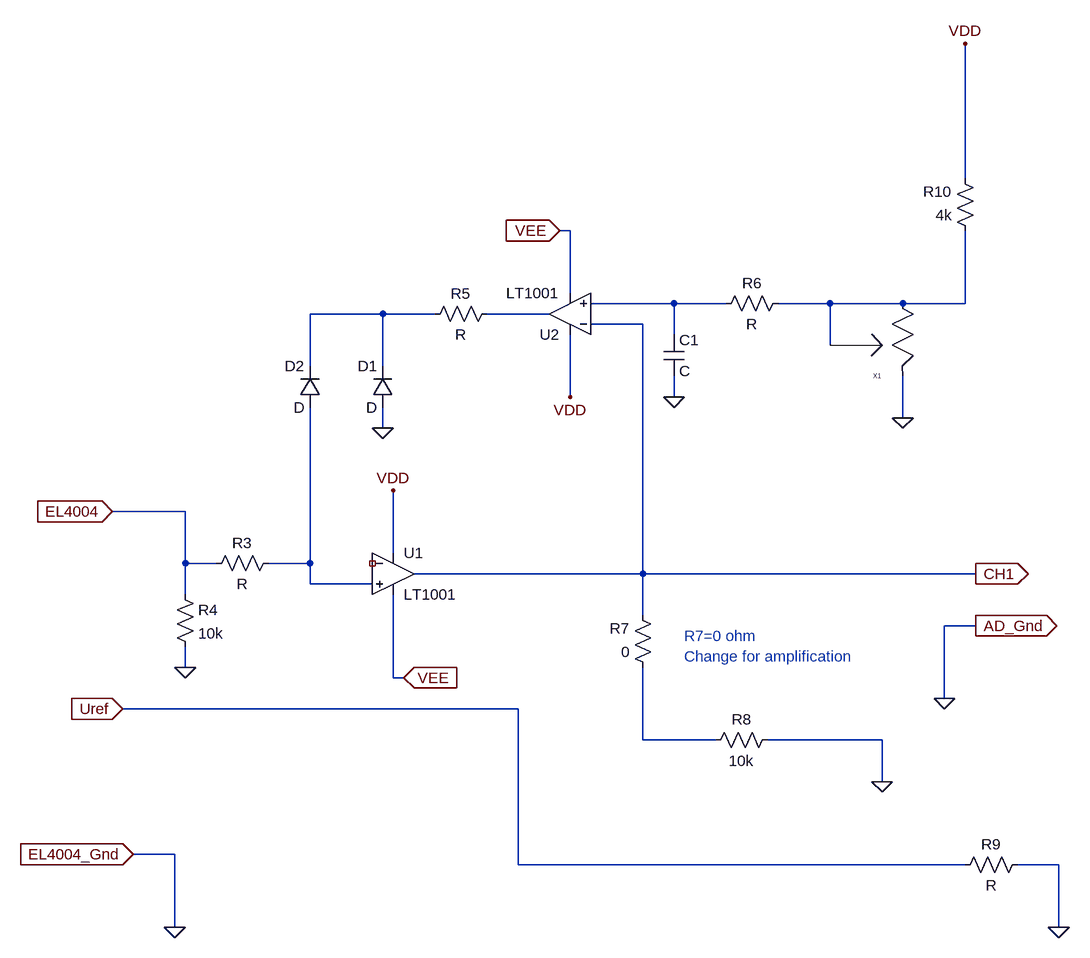
[diagram p0: schematic Booster Buffer.asc]
Booster Buffer.asc, the LTspice schematic file:
Version 4
SHEET 1 1968 692
WIRE 1296 -480 1296 -688
WIRE 688 -400 672 -400
WIRE 688 -304 688 -400
WIRE 848 -288 720 -288
WIRE 928 -288 848 -288
WIRE 1088 -288 1008 -288
WIRE 1200 -288 1088 -288
WIRE 1296 -288 1296 -400
WIRE 1296 -288 1200 -288
WIRE 400 -272 288 -272
WIRE 480 -272 400 -272
WIRE 656 -272 560 -272
WIRE 800 -256 720 -256
WIRE 848 -240 848 -288
WIRE 1088 -224 1088 -288
WIRE 288 -192 288 -272
WIRE 400 -192 400 -272
WIRE 688 -144 688 -240
WIRE 848 -144 848 -176
WIRE 1200 -112 1200 -176
WIRE 400 -96 400 -128
WIRE 96 32 -16 32
WIRE 416 96 416 0
WIRE 96 112 96 32
WIRE 144 112 96 112
WIRE 288 112 288 -128
WIRE 288 112 224 112
WIRE 800 128 800 -256
WIRE 800 128 448 128
WIRE 1312 128 800 128
WIRE 288 144 288 112
WIRE 384 144 288 144
WIRE 96 160 96 112
WIRE 800 192 800 128
WIRE 1312 208 1264 208
WIRE 96 272 96 240
WIRE 416 288 416 160
WIRE 432 288 416 288
WIRE 1264 320 1264 208
WIRE 608 336 0 336
WIRE 800 384 800 272
WIRE 912 384 800 384
WIRE 1168 384 992 384
WIRE 1168 448 1168 384
WIRE 80 560 16 560
WIRE 608 576 608 336
WIRE 1296 576 608 576
WIRE 1440 576 1376 576
WIRE 80 672 80 560
WIRE 1440 672 1440 576
FLAG -16 32 EL4004
IOPIN -16 32 In
FLAG 0 336 Uref
IOPIN 0 336 In
FLAG 16 560 EL4004_Gnd
IOPIN 16 560 In
FLAG 432 288 VEE
IOPIN 432 288 In
FLAG 672 -400 VEE
IOPIN 672 -400 In
FLAG 416 0 VDD
FLAG 688 -144 VDD
FLAG 1296 -688 VDD
FLAG 400 -96 0
FLAG 848 -144 0
FLAG 1264 320 0
FLAG 1168 448 0
FLAG 1312 128 CH1
IOPIN 1312 128 Out
FLAG 1312 208 AD_Gnd
IOPIN 1312 208 Out
FLAG 1200 -112 0
FLAG 96 272 0
FLAG 1440 672 0
FLAG 80 672 0
SYMBOL res 240 96 R90
WINDOW 0 0 56 VBottom 2
WINDOW 3 32 56 VTop 2
SYMATTR InstName R3
SYMBOL res 80 144 R0
SYMATTR InstName R4
SYMATTR Value 10k
SYMBOL res 576 -288 R90
WINDOW 0 0 56 VBottom 2
WINDOW 3 32 56 VTop 2
SYMATTR InstName R5
SYMBOL res 1024 -304 R90
WINDOW 0 0 56 VBottom 2
WINDOW 3 32 56 VTop 2
SYMATTR InstName R6
SYMBOL res 816 288 R180
WINDOW 0 36 76 Left 2
WINDOW 3 36 40 Left 2
SYMATTR InstName R7
SYMATTR Value 0
SYMBOL res 896 400 R270
WINDOW 0 32 56 VTop 2
WINDOW 3 0 56 VBottom 2
SYMATTR InstName R8
SYMATTR Value 10k
SYMBOL res 1280 592 R270
WINDOW 0 32 56 VTop 2
WINDOW 3 0 56 VBottom 2
SYMATTR InstName R9
SYMBOL res 1312 -384 R180
WINDOW 0 36 76 Left 2
WINDOW 3 36 40 Left 2
SYMATTR InstName R10
SYMATTR Value 4k
SYMBOL diode 416 -128 R180
WINDOW 0 24 64 Left 2
WINDOW 3 24 0 Left 2
SYMATTR InstName D1
SYMBOL diode 304 -128 R180
WINDOW 0 24 64 Left 2
WINDOW 3 24 0 Left 2
SYMATTR InstName D2
SYMBOL OpAmps\\LT1001 416 64 R0
SYMATTR InstName U1
SYMBOL OpAmps\\LT1001 688 -208 R180
SYMATTR InstName U2
SYMBOL cap 832 -240 R0
SYMATTR InstName C1
SYMBOL pot 1216 -192 R180
SYMATTR InstName X1
SYMATTR SpiceLine R=10k val=50
TEXT 864 224 Left 2 ;R7=0 ohm\nChange for amplification

The netlist it stands for:
* Booster Buffer.asc
R3 N005 EL4004 R
R4 EL4004 0 10k
R5 N004 N003 R
R6 N002 N001 R
R7 N006 CH1 0
R8 N006 0 10k
R9 Uref 0 R
R10 N002 VDD 4k
D1 0 N003 D
D2 N005 N003 D
XU1 N005 NC_01 VDD VEE CH1 LT1001  ; pins In+ In- V+ V- OUT
XU2 N001 CH1 VDD VEE N004 LT1001  ; pins In+ In- V+ V- OUT
C1 N001 0 C
XX1 0 N002 N002 pot R=10k val=50  ; pins 1 2 3
.model D D
.lib standard.dio
* R7=0 ohm
* Change for amplification
.lib LTC.lib
.backanno
.end